# Altium schematic sheet 1000BASET1_MEDIA_CONVERTER.SchDoc
size C; SheetNumber: 1; SheetTotal: 5
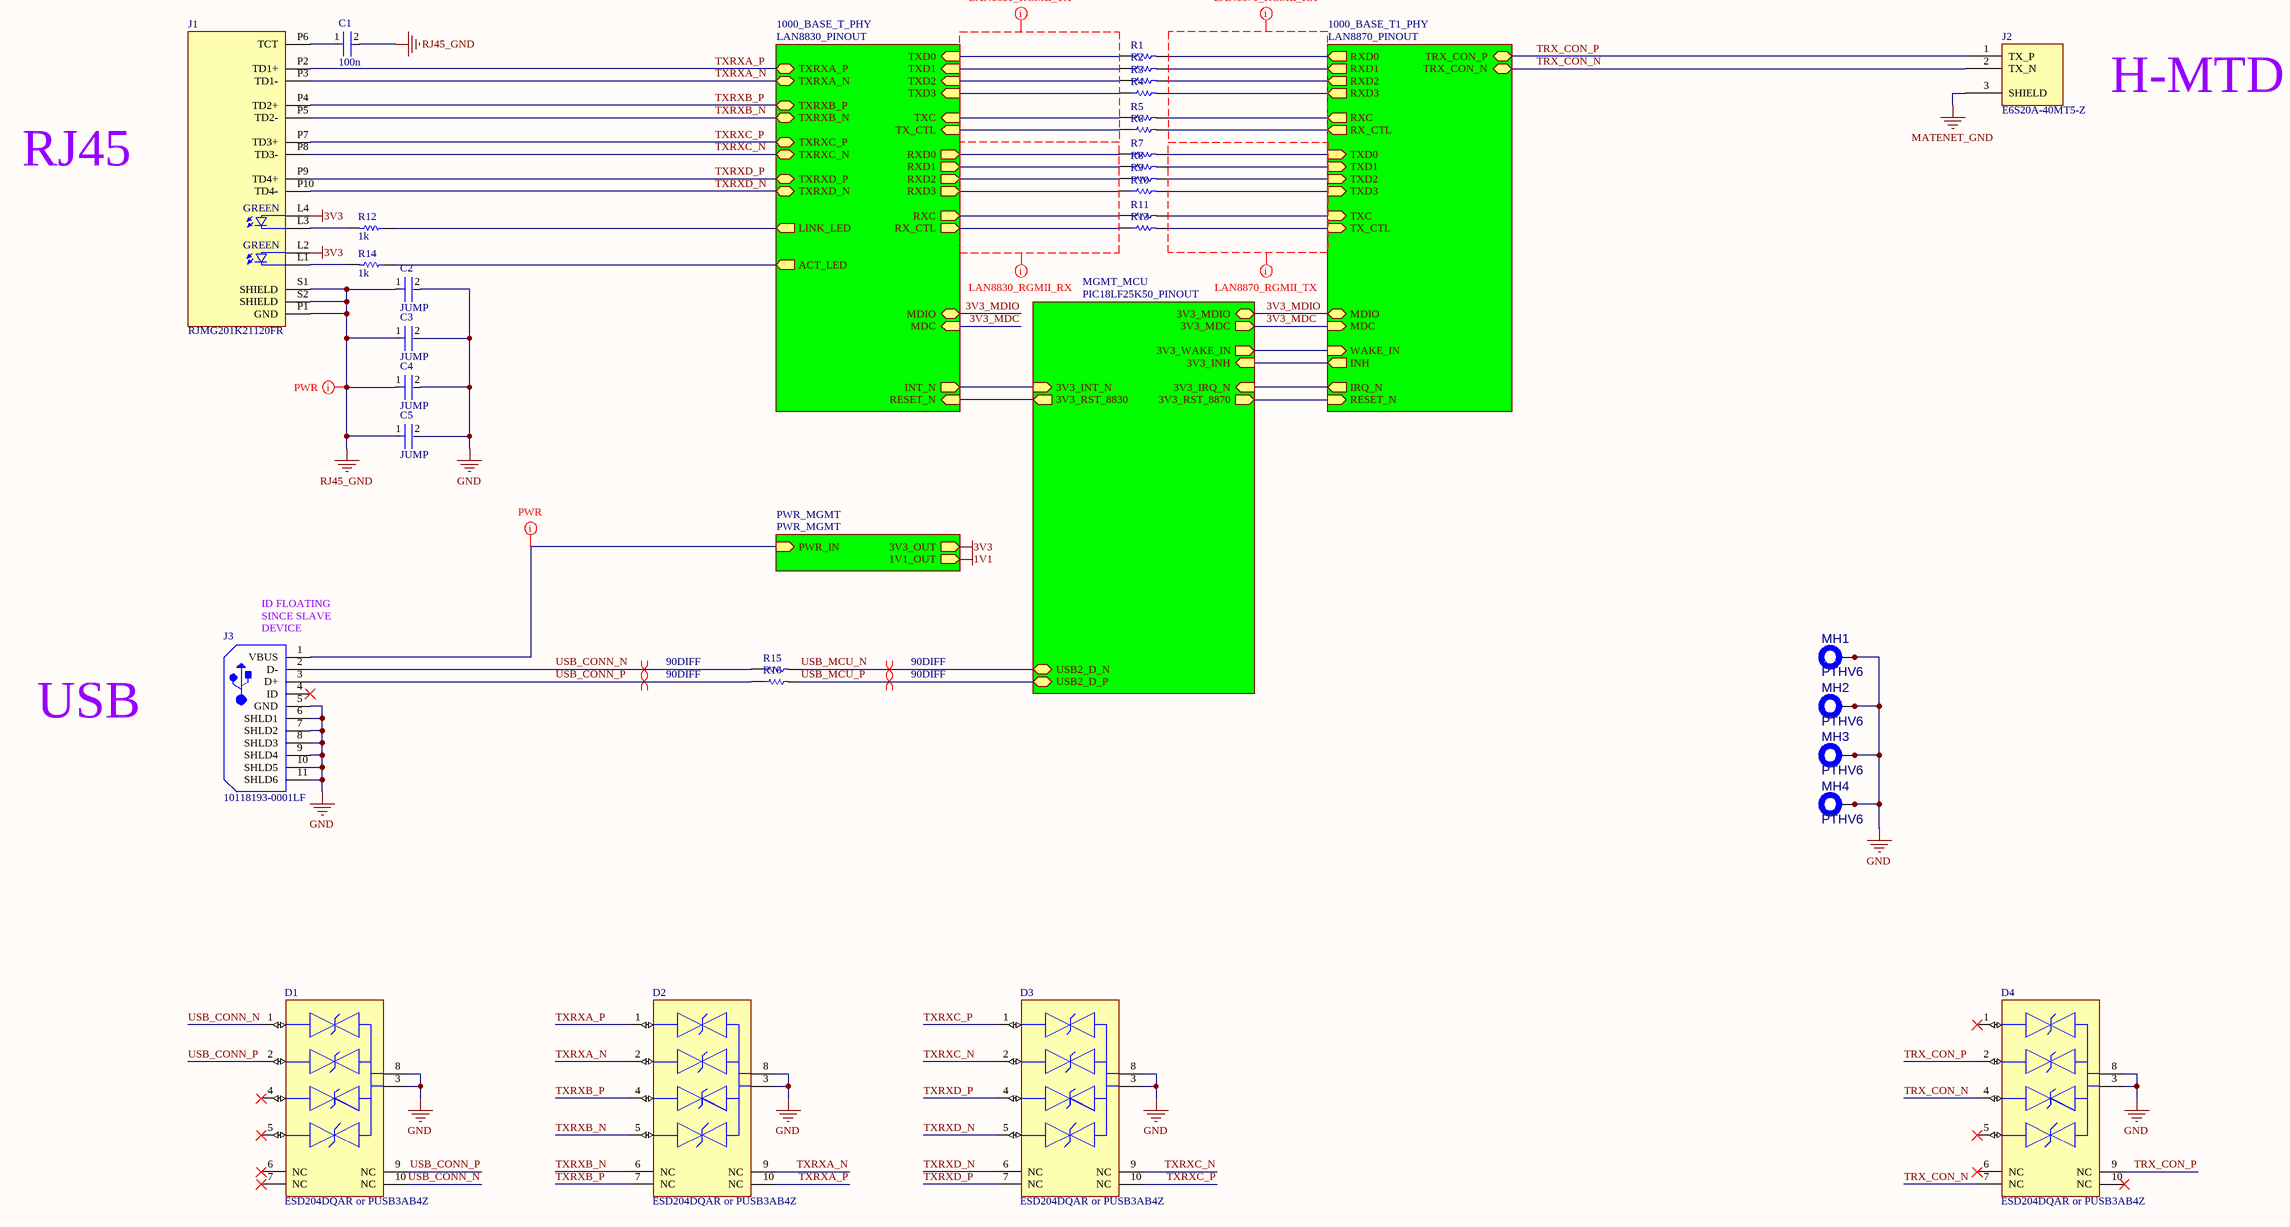
[diagram p0: 1000BASET1_MEDIA_CONVERTER.SchDoc]

## Parts
C1  100n  [FP-0402-L_1_0_0_05-W_0_5-IPC_A]
C2  JUMP  [FP-0402-L_1_0_0_05-W_0_5-IPC_A]
C3  JUMP  [FP-0402-L_1_0_0_05-W_0_5-IPC_A]
C4  JUMP  [FP-0402-L_1_0_0_05-W_0_5-IPC_A]
C5  JUMP  [FP-0402-L_1_0_0_05-W_0_5-IPC_A]
D1  ESD204DQAR or PUSB3AB4Z  [FP-DQA0010A-MFG]
D2  ESD204DQAR or PUSB3AB4Z  [FP-DQA0010A-MFG]
D3  ESD204DQAR or PUSB3AB4Z  [FP-DQA0010A-MFG]
D4  ESD204DQAR or PUSB3AB4Z  [FP-DQA0010A-MFG]
J1  RJMG201K21120FR  [RJMG201K21120FR-Footprint-1]
J2  E6S20A-40MT5-Z  [E6S20A-40MT5-Z-Footprint-1]
J3  10118193-0001LF  [FCI-10118193-0001LF-5_V]
MH1  PTHV6  [PTHV6 M2]  (net tie, no BOM)
MH2  PTHV6  [PTHV6 M2]  (net tie, no BOM)
MH3  PTHV6  [PTHV6 M2]  (net tie, no BOM)
MH4  PTHV6  [PTHV6 M2]  (net tie, no BOM)
R1  0402 JUMPER  [RESC1005X40X25ML05T05]  (value not drawn)
R2  0402 JUMPER  [RESC1005X40X25ML05T05]  (value not drawn)
R3  0402 JUMPER  [RESC1005X40X25ML05T05]  (value not drawn)
R4  0402 JUMPER  [RESC1005X40X25ML05T05]  (value not drawn)
R5  0402 JUMPER  [RESC1005X40X25ML05T05]  (value not drawn)
R6  0402 JUMPER  [RESC1005X40X25ML05T05]  (value not drawn)
R7  0402 JUMPER  [RESC1005X40X25ML05T05]  (value not drawn)
R8  0402 JUMPER  [RESC1005X40X25ML05T05]  (value not drawn)
R9  0402 JUMPER  [RESC1005X40X25ML05T05]  (value not drawn)
R10  0402 JUMPER  [RESC1005X40X25ML05T05]  (value not drawn)
R11  0402 JUMPER  [RESC1005X40X25ML05T05]  (value not drawn)
R12  1k  [R0603B]
R13  0402 JUMPER  [RESC1005X40X25ML05T05]  (value not drawn)
R14  1k  [R0603B]
R15  0402 JUMPER  [RESC1005X40X25ML05T05]  (value not drawn)
R16  0402 JUMPER  [RESC1005X40X25ML05T05]  (value not drawn)

## Sub-sheets
1000_BASE_T1_PHY = LAN8870_PINOUT: RXD0 (out), RXD1 (out), RXD2 (out), RXD3 (out), RXC (out), RX_CTL (out), TXD0 (in), TXD1 (in), TXD2 (in), TXD3 (in), TXC (in), TX_CTL (in), TRX_CON_P (bidir), TRX_CON_N (bidir), MDIO (bidir), MDC (in), IRQ_N (out), RESET_N (in), WAKE_IN (in), INH (out)
1000_BASE_T_PHY = LAN8830_PINOUT: TXD0 (in), TXD1 (in), TXD2 (in), TXD3 (in), TXC (in), TX_CTL (in), RXD0 (out), RXD1 (out), RXD2 (out), RXD3 (out), RXC (out), RX_CTL (out), TXRXA_P (bidir), TXRXA_N (bidir), TXRXB_P (bidir), TXRXB_N (bidir), TXRXC_P (bidir), TXRXC_N (bidir), TXRXD_P (bidir), TXRXD_N (bidir), ACT_LED (out), LINK_LED (out), MDIO (bidir), MDC (in), INT_N (out), RESET_N (in)
MGMT_MCU = PIC18LF25K50_PINOUT: 3V3_INH (in), 3V3_WAKE_IN (out), 3V3_RST_8870 (out), 3V3_IRQ_N (in), 3V3_RST_8830 (out), 3V3_INT_N (in), USB2_D_N (bidir), USB2_D_P (bidir), 3V3_MDC (out), 3V3_MDIO (bidir)
PWR_MGMT = PWR_MGMT: PWR_IN (in), 1V1_OUT (out), 3V3_OUT (out)

## Nets
1V1: sheet PWR_MGMT/1V1_OUT
3V3: J1.L2 J1.L4 ; sheet PWR_MGMT/3V3_OUT
GND: C2.2 C3.2 C4.2 C5.2 D1.3(GND) D1.8(GND) D2.3(GND) D2.8(GND) D3.3(GND) D3.8(GND) D4.3(GND) D4.8(GND) J3.5(GND) J3.6(SHLD1) J3.7(SHLD2) J3.8(SHLD3) J3.9(SHLD4) J3.10(SHLD5) J3.11(SHLD6) MH1.1(MH) MH1.2(V1) MH1.3(V2) MH1.4(V3) MH1.5(V4) MH1.6(V5) MH1.7(V6) MH2.1(MH) MH2.2(V1) MH2.3(V2) MH2.4(V3) MH2.5(V4) MH2.6(V5) MH2.7(V6) MH3.1(MH) MH3.2(V1) MH3.3(V2) MH3.4(V3) MH3.5(V4) MH3.6(V5) MH3.7(V6) MH4.1(MH) MH4.2(V1) MH4.3(V2) MH4.4(V3) MH4.5(V4) MH4.6(V5) MH4.7(V6)
MATENET_GND: J2.3(SHIELD)
RJ45_GND: C1.2 C2.1 C3.1 C4.1 C5.1 J1.P1(GND) J1.S1(SHIELD) J1.S2(SHIELD)
3V3_MDC: sheet 1000_BASE_T_PHY/MDC, sheet 1000_BASE_T1_PHY/MDC, sheet MGMT_MCU/3V3_MDC
3V3_MDIO: sheet 1000_BASE_T_PHY/MDIO, sheet 1000_BASE_T1_PHY/MDIO, sheet MGMT_MCU/3V3_MDIO
TRX_CON_N: D4.4(IO3) D4.7(NC) J2.2(TX_N) ; sheet 1000_BASE_T1_PHY/TRX_CON_N
TRX_CON_P: D4.2(IO2) D4.9(NC) J2.1(TX_P) ; sheet 1000_BASE_T1_PHY/TRX_CON_P
TXRXA_N: D2.2(IO2) D2.9(NC) J1.P3(TD1-) ; sheet 1000_BASE_T_PHY/TXRXA_N
TXRXA_P: D2.1(IO1) D2.10(NC) J1.P2(TD1+) ; sheet 1000_BASE_T_PHY/TXRXA_P
TXRXB_N: D2.5(IO4) D2.6(NC) J1.P5(TD2-) ; sheet 1000_BASE_T_PHY/TXRXB_N
TXRXB_P: D2.4(IO3) D2.7(NC) J1.P4(TD2+) ; sheet 1000_BASE_T_PHY/TXRXB_P
TXRXC_N: D3.2(IO2) D3.9(NC) J1.P8(TD3-) ; sheet 1000_BASE_T_PHY/TXRXC_N
TXRXC_P: D3.1(IO1) D3.10(NC) J1.P7(TD3+) ; sheet 1000_BASE_T_PHY/TXRXC_P
TXRXD_N: D3.5(IO4) D3.6(NC) J1.P10(TD4-) ; sheet 1000_BASE_T_PHY/TXRXD_N
TXRXD_P: D3.4(IO3) D3.7(NC) J1.P9(TD4+) ; sheet 1000_BASE_T_PHY/TXRXD_P
USB_CONN_N: D1.1(IO1) D1.10(NC) J3.2(D-) R15.1
USB_CONN_P: D1.2(IO2) D1.9(NC) J3.3(D+) R16.1
USB_MCU_N: R15.2 ; sheet MGMT_MCU/USB2_D_N
USB_MCU_P: R16.2 ; sheet MGMT_MCU/USB2_D_P
NetC1_1: C1.1 J1.P6(TCT)
NetJ1_L1: J1.L1 R14.2
NetJ1_L3: J1.L3 R12.2
NetJ3_1: J3.1(VBUS) ; sheet PWR_MGMT/PWR_IN
NetR1_1: R1.1 ; sheet 1000_BASE_T_PHY/TXD0
NetR1_2: R1.2 ; sheet 1000_BASE_T1_PHY/RXD0
NetR2_1: R2.1 ; sheet 1000_BASE_T_PHY/TXD1
NetR2_2: R2.2 ; sheet 1000_BASE_T1_PHY/RXD1
NetR3_1: R3.1 ; sheet 1000_BASE_T_PHY/TXD2
NetR3_2: R3.2 ; sheet 1000_BASE_T1_PHY/RXD2
NetR4_1: R4.1 ; sheet 1000_BASE_T_PHY/TXD3
NetR4_2: R4.2 ; sheet 1000_BASE_T1_PHY/RXD3
NetR5_1: R5.1 ; sheet 1000_BASE_T_PHY/TXC
NetR5_2: R5.2 ; sheet 1000_BASE_T1_PHY/RXC
NetR6_1: R6.1 ; sheet 1000_BASE_T_PHY/TX_CTL
NetR6_2: R6.2 ; sheet 1000_BASE_T1_PHY/RX_CTL
NetR7_1: R7.1 ; sheet 1000_BASE_T_PHY/RXD0
NetR7_2: R7.2 ; sheet 1000_BASE_T1_PHY/TXD0
NetR8_1: R8.1 ; sheet 1000_BASE_T_PHY/RXD1
NetR8_2: R8.2 ; sheet 1000_BASE_T1_PHY/TXD1
NetR9_1: R9.1 ; sheet 1000_BASE_T_PHY/RXD2
NetR9_2: R9.2 ; sheet 1000_BASE_T1_PHY/TXD2
NetR10_1: R10.1 ; sheet 1000_BASE_T_PHY/RXD3
NetR10_2: R10.2 ; sheet 1000_BASE_T1_PHY/TXD3
NetR11_1: R11.1 ; sheet 1000_BASE_T_PHY/RXC
NetR11_2: R11.2 ; sheet 1000_BASE_T1_PHY/TXC
NetR12_1: R12.1 ; sheet 1000_BASE_T_PHY/LINK_LED
NetR13_1: R13.1 ; sheet 1000_BASE_T_PHY/RX_CTL
NetR13_2: R13.2 ; sheet 1000_BASE_T1_PHY/TX_CTL
NetR14_1: R14.1 ; sheet 1000_BASE_T_PHY/ACT_LED
(unnamed): sheet 1000_BASE_T_PHY/INT_N, sheet MGMT_MCU/3V3_INT_N
(unnamed): sheet 1000_BASE_T_PHY/RESET_N, sheet MGMT_MCU/3V3_RST_8830
(unnamed): sheet 1000_BASE_T1_PHY/IRQ_N, sheet MGMT_MCU/3V3_IRQ_N
(unnamed): sheet 1000_BASE_T1_PHY/RESET_N, sheet MGMT_MCU/3V3_RST_8870
(unnamed): sheet 1000_BASE_T1_PHY/WAKE_IN, sheet MGMT_MCU/3V3_WAKE_IN
(unnamed): sheet 1000_BASE_T1_PHY/INH, sheet MGMT_MCU/3V3_INH

Not connected (* = marked no-connect by the designer): D1 4(IO3)* 5(IO4)* 6(NC)* 7(NC)*; D4 1(IO1)* 5(IO4)* 6(NC)* 10(NC)*; J3 4(ID)*

## Layout directives
differential pair; differential pair class 90DIFF: USB_CONN_N, USB_CONN_P, USB_MCU_N, USB_MCU_P
net class LAN8830_RGMII_TX: (no net found under the mark)
net class LAN8870_RGMII_RX: (no net found under the mark)
net class LAN8870_RGMII_TX: (no net found under the mark)
net class LAN8830_RGMII_RX: (no net found under the mark)
net class PWR: NetJ3_1, RJ45_GND

## Notes on the sheet
- H-MTD
- RJ45
- (near J3) ID FLOATING SINCE SLAVE DEVICE
- USB
- (in symbol CMP-002-00090-1) GREEN

## Library data of the parts
C1-C5 = CMP-001-00058-1: LARGE PADS, 0402 CAP, CHANGE COMMENT TO MATCH REAL P/N; Capacitor Type: Ceramic; Min Operating Temperature: -55°C; Mounting Technology: Surface Mount; Pins: 2; Case/Package: 0402; RoHS Compliant: Yes; Max Operating Temperature: 85°C
D1-D4 = CMP-04989-000002-1: 4-CHANNEL LOW-CAPACITANCE SURGE; Manufacturer: Texas Instruments; Value: 0.55pF; Reverse Standoff Voltage: 3.6V; Standoff Height: 0mm; Breakdown Voltage: 5.5V; Peak Pulse Current: 5.5A; Clamping Voltage: 11.5V; Direction: Bidirectional; Peak Pulse Power: 50W; Number Of Channels: 4; Ambient Temperature Range High: +125°C; ComponentLink2Description: Datasheet; Height: 0.55mm; Lead Free: Yes; Device Class L3: unset; Temperature Range High: +125°C; Temperature Range Low: -40°C; Package: DQA0010A; Temperature: -40°C to +125°C; Capacitance: 0.55pF; RoHS: TRUE; Mouser Description: 4-Channel Low-Capacitance Surge and ESD Protection Diode 10-USON -40 to 125; Category: Diode; Device Class L1: Circuit Protection; Octopart: https://octopart.com/esd204dqar-texas+instruments-89917476; Device Class L2: TVS Diodes; Ambient Temperature Range Low: -40°C; Manufacturer Part Number: ESD204DQAR; ComponentLink2URL: http://www.ti.com/lit/ds/symlink/esd204.pdf; Automotive: No; Digikey Description: 4-CHANNEL LOW-CAPACITANCE SURGE
J1 = CMP-002-00090-1: Connector RJ45 Receptacle 8 Position Solder Straight Through Hole 1 Port Tray; Pins: 8; Max Operating Temperature: 70°C; Min Operating Temperature: 0°C
J2 = CMP-002-00103-1: RF Connector, 2 Contact(s), Male, Panel Mount, Board And Panel Mount, Solder Terminal, Plug; Pins: 2; Min Operating Temperature: -40°C; Max Operating Temperature: 105°C
J3 = CMP-2000-05119-1: Micro USB B Type Receptacle, -55 to 85 degC, 5-Pin SMD, RoHS, Tape and Reel; Manufacturer: FCI; Insulation Resistance: 1000MOhms; Gender: Female; Current Rating: 1.8A; Number of Contacts: 5Contact; Connector Type: MicroUSBTypeBreceptacle; Mounting Angle: Right; Datasheet Version: Rev. C, 05/2015; Packaging: Reel; Product Category: USBConnectors; Standard: USB2.0; Factory Pack Quantity: 1200; Operating Temperature Range: -55Cto+85C; Termination Style: SMD/SMT; Datasheet URL: http://datasheet.octopart.com/10118193-0001LF-FCI-datasheet-55953155.pdf; Contact Material: CopperAlloy; RoHS: Details; Contact Plating: Gold; Flammability Rating: UL94V-0; Manufacturer URL: http://www.fci.com/; Brand: FCI; Product: MicroUSBTypeBConnectors; Color: Black
MH1-MH4 = CMP-00028-00001-13: Plated mounting hole with 6 peripheral vias. This is a generic symbol that groups all relevant footprints.
R1-R11 R13 R15 R16 = CMP-009-00118-2: READ THE NAME; Pins: 2; Component Type: Standard; Design Item ID: CMP-009-00206-2; Source: 0402jump.SchLib
R12 R14 = CMP-009-00002-14: Resistor; Value: 1k